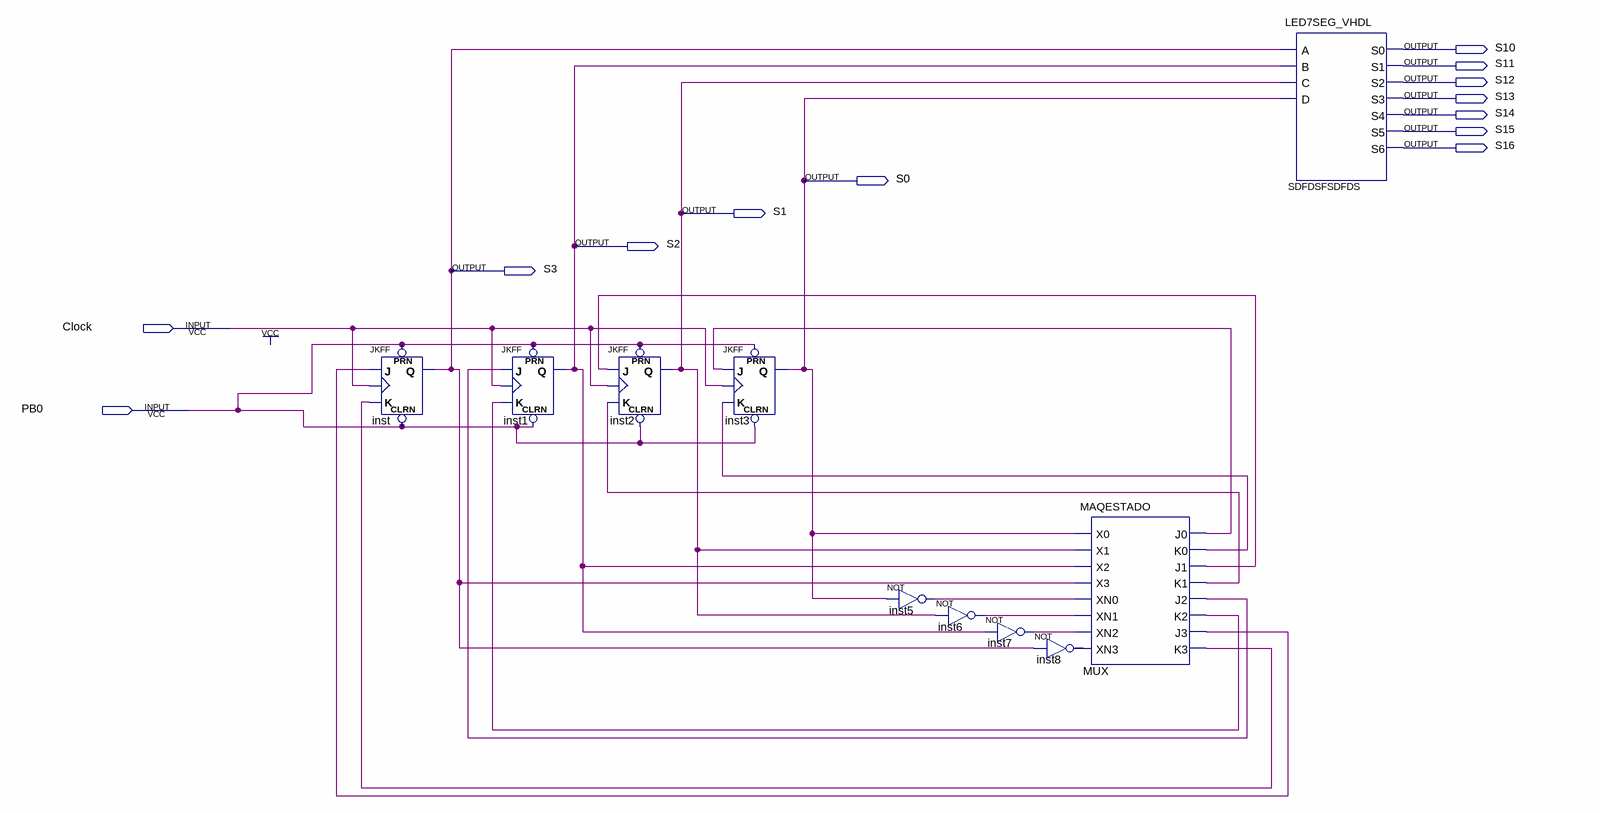
[diagram p0: schematic sheet]
// Quartus schematic LAB04_MAQUINA_DE_ESTADO.bdf as structural Verilog: 10 symbols, 13 pins
module LAB04_MAQUINA_DE_ESTADO (
  input  Clock,
  input  PB0,
  output S10,
  output S11,
  output S12,
  output S13,
  output S14,
  output S15,
  output S16,
  output S0,
  output S1,
  output S2,
  output S3
);

  wire inst5_out, inst6_out, inst7_out, inst8_out, MUX_j0, MUX_j1, MUX_j2, MUX_j3, MUX_k0, MUX_k1, MUX_k2,
       MUX_k3;

  JKFF inst (.PRN(PB0), .CLRN(PB0), .K(MUX_k3), .J(MUX_j3), .CLK(Clock), .Q(S3));
  JKFF inst1 (.PRN(PB0), .CLRN(PB0), .K(MUX_k2), .J(MUX_j2), .CLK(Clock), .Q(S2));
  JKFF inst2 (.PRN(PB0), .CLRN(PB0), .K(MUX_k1), .J(MUX_j1), .CLK(Clock), .Q(S1));
  JKFF inst3 (.PRN(PB0), .CLRN(PB0), .K(MUX_k0), .J(MUX_j0), .CLK(Clock), .Q(S0));
  not inst5 (inst5_out, S0);
  not inst6 (inst6_out, S1);
  not inst7 (inst7_out, S2);
  not inst8 (inst8_out, S3);
  MAQESTADO MUX (
    .X0(S0), .X1(S1), .X2(S2), .X3(S3), .XN0(inst5_out), .XN1(inst6_out), .XN2(inst7_out), .XN3(inst8_out),
    .J0(MUX_j0), .K0(MUX_k0), .J1(MUX_j1), .K1(MUX_k1), .J2(MUX_j2), .K2(MUX_k2), .J3(MUX_j3), .K3(MUX_k3));
  LED7SEG_VHDL SDFDSFSDFDS (
    .A(S3), .B(S2), .C(S1), .D(S0), .S0(S10), .S1(S11), .S2(S12), .S3(S13), .S4(S14), .S5(S15), .S6(S16));
endmodule
